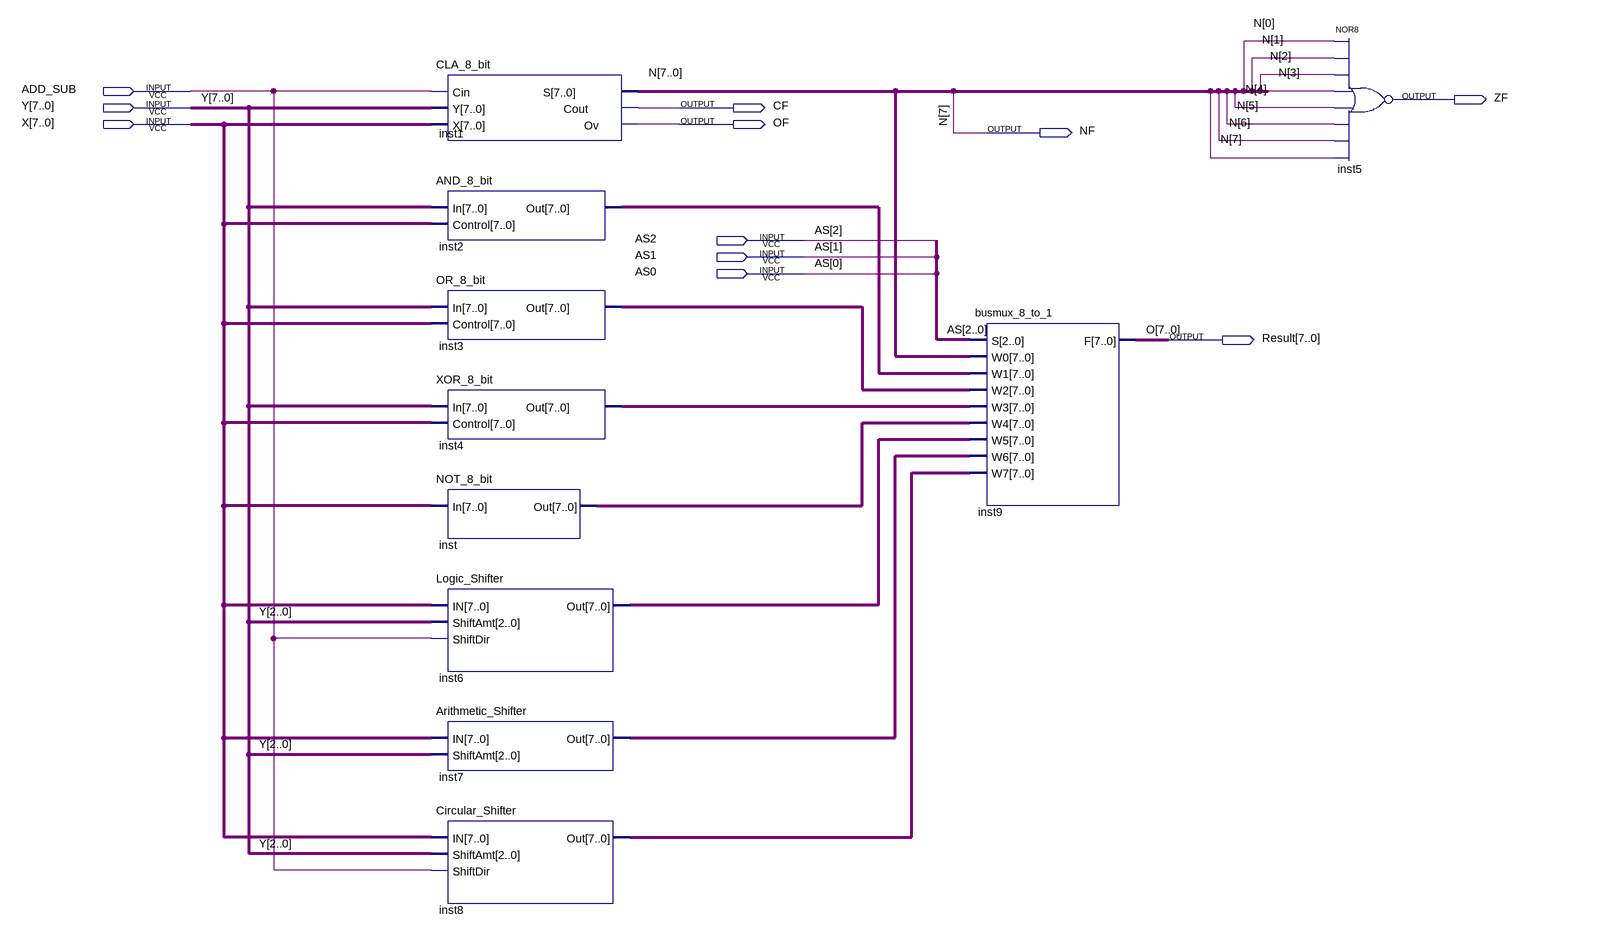
[diagram p0: schematic sheet]
// Quartus schematic ALU.bdf as structural Verilog: 10 symbols, 11 pins
module ALU (
  input  ADD_SUB,
  input  [7:0] Y,
  input  [7:0] X,
  input  AS2,
  input  AS1,
  input  AS0,
  output ZF,
  output CF,
  output OF,
  output NF,
  output [7:0] Result
);

  wire [6:0] N;
  wire [7:0] inst2_out, inst3_out, inst4_out, inst6_out, inst7_out, inst8_out, inst_out;

  CLA_8_bit inst1 (.Cin(ADD_SUB), .Y(Y), .X(X), .S({NF, N}), .Cout(CF), .Ov(OF));
  AND_8_bit inst2 (.In(Y), .Control(X), .Out(inst2_out));
  OR_8_bit inst3 (.In(Y), .Control(X), .Out(inst3_out));
  XOR_8_bit inst4 (.In(Y), .Control(X), .Out(inst4_out));
  NOT_8_bit inst (.In(X), .Out(inst_out));
  Logic_Shifter inst6 (.IN(X), .ShiftAmt(Y[2:0]), .ShiftDir(ADD_SUB), .Out(inst6_out));
  Arithmetic_Shifter inst7 (.IN(X), .ShiftAmt(Y[2:0]), .Out(inst7_out));
  Circular_Shifter inst8 (.IN(X), .ShiftAmt(Y[2:0]), .ShiftDir(ADD_SUB), .Out(inst8_out));
  busmux_8_to_1 inst9 (
    .S({AS2, AS1, AS0}), .W0({NF, N}), .W1(inst2_out), .W2(inst3_out), .W3(inst4_out), .W4(inst_out),
    .W5(inst6_out), .W6(inst7_out), .W7(inst8_out), .F(Result));
  nor inst5 (ZF, N[0], N[1], N[2], N[3], N[4], N[5], N[6], NF);

  // Other names for the same wires on the sheet: N[7] = NF; O[7:0] = Result
endmodule
